# Altium project STM32_Clock.PrjPcb
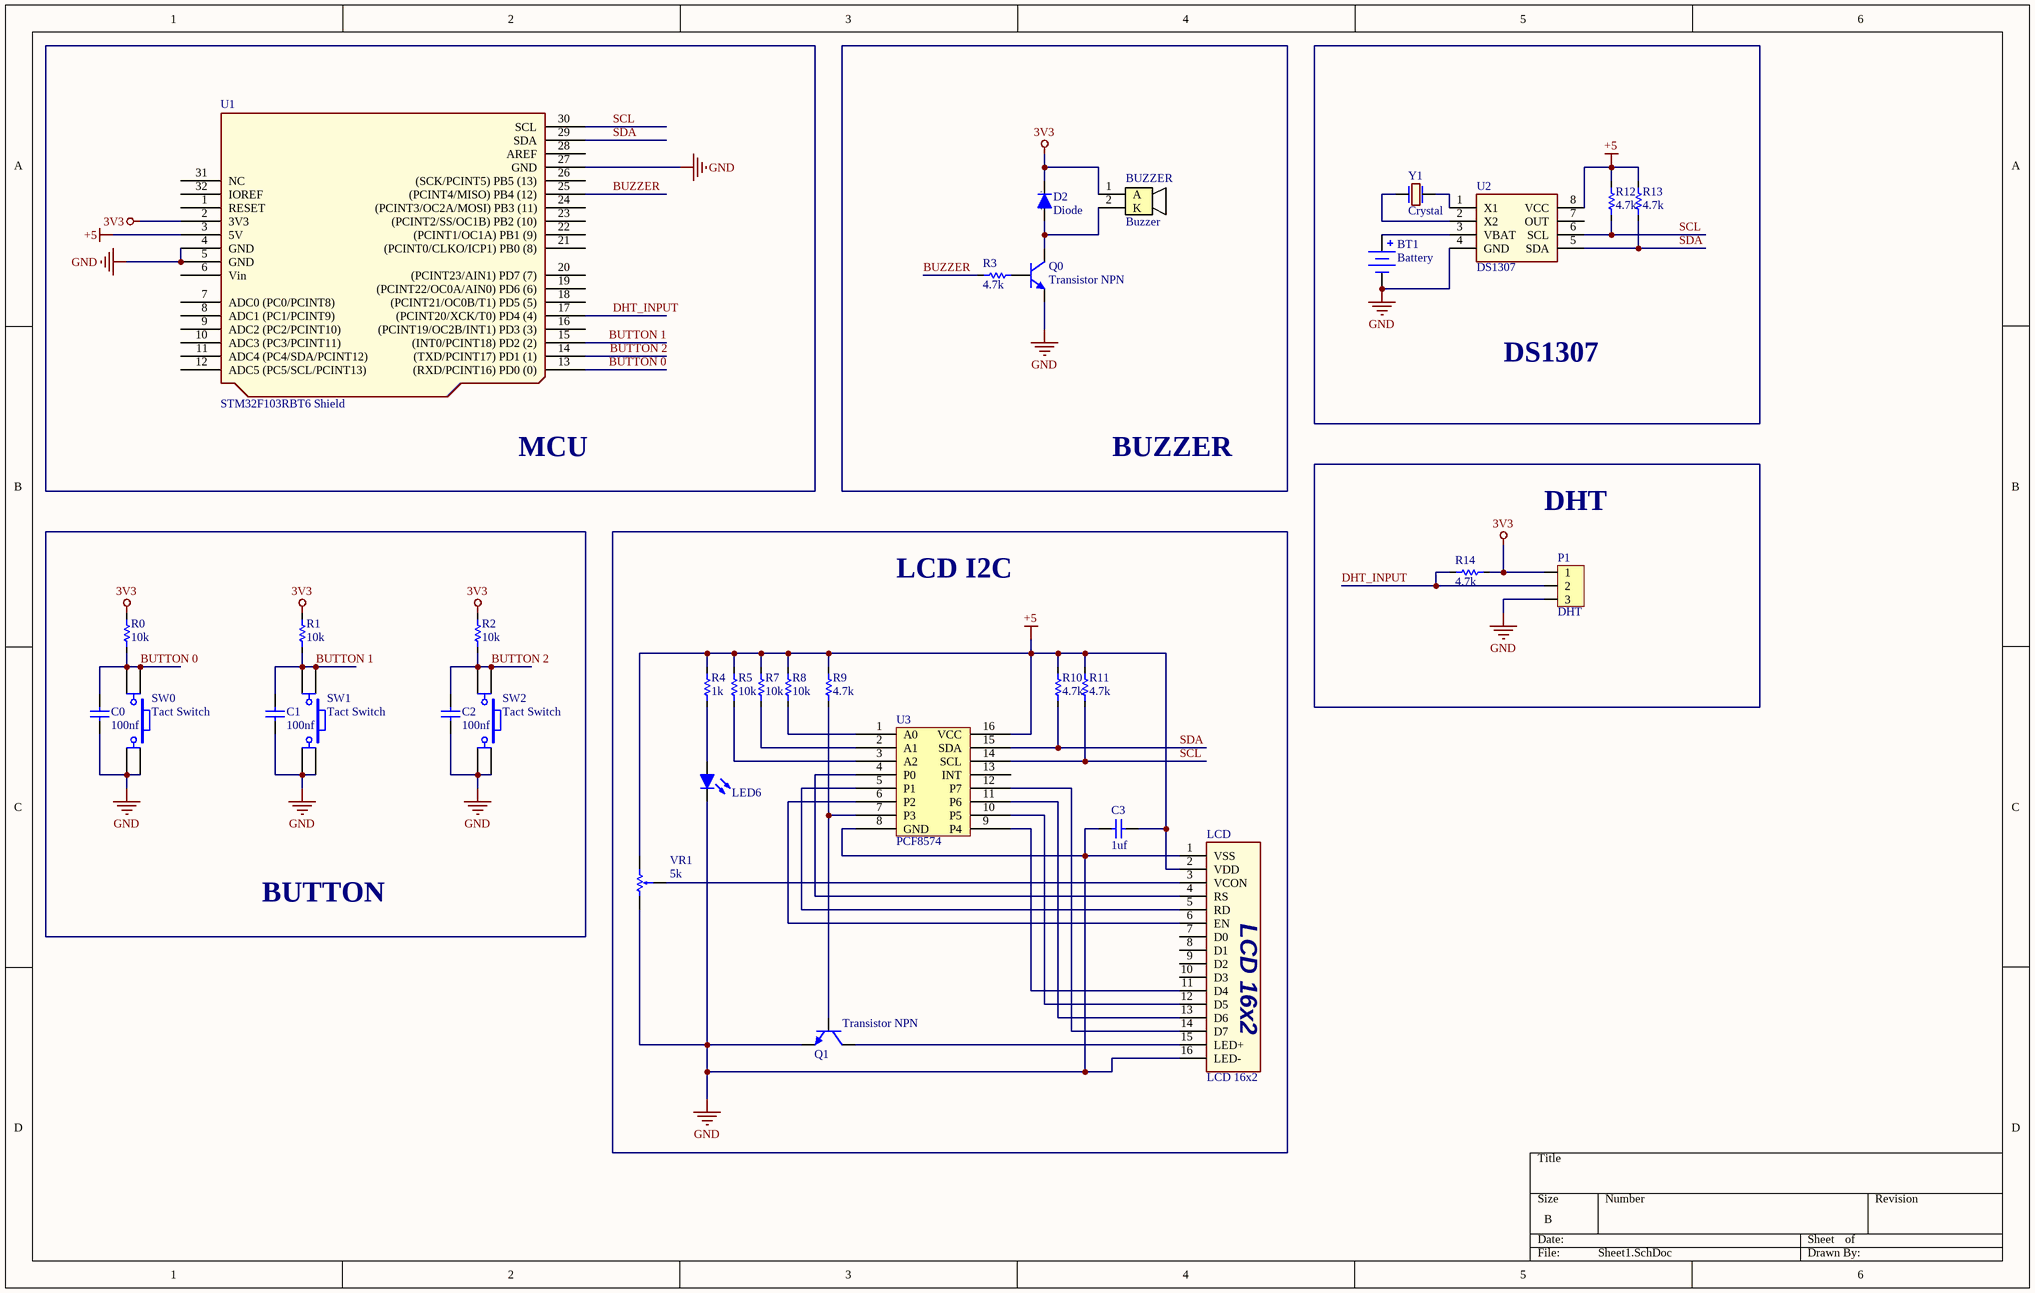
[diagram p0: Sheet1.SchDoc]
1 sheet, 34 parts. Net scope: global (net labels, ports and power ports of the same name join across sheets).
Board file: PCB1.PcbDoc

## Sheet Sheet1.SchDoc
size B; SheetNumber: 1; SheetTotal: 1

### Parts
BT1  Battery  [CON CR2032]
BUZZER  Buzzer  [BUZZER]
C0  100nf  [C 0805 (2012)]
C1  100nf  [C 0805 (2012)]
C2  100nf  [C 0805 (2012)]
C3  1uf  [C 0805 (2012)]
D2  Diode  [SOD-80]
LCD  LCD 16x2  [LCD 16x2]
LED6  Led  [Led SMD 0805]  (value not drawn)
P1  DHT  [XH2.54-3P]
Q0  Transistor NPN  [SOT-23]
Q1  Transistor NPN  [SOT-23]
R0  10k  [R 0805 (2012)]
R1  10k  [R 0805 (2012)]
R2  10k  [R 0805 (2012)]
R3  4.7k  [R 0805 (2012)]
R4  1k  [R 0805 (2012)]
R5  10k  [R 0805 (2012)]
R7  10k  [R 0805 (2012)]
R8  10k  [R 0805 (2012)]
R9  4.7k  [R 0805 (2012)]
R10  4.7k  [R 0805 (2012)]
R11  4.7k  [R 0805 (2012)]
R12  4.7k  [R 0805 (2012)]
R13  4.7k  [R 0805 (2012)]
R14  4.7k  [R 0805 (2012)]
SW0  Tact Switch  [SW/4/DIP 12x12x7]
SW1  Tact Switch  [SW/4/DIP 12x12x7]
SW2  Tact Switch  [SW/4/DIP 12x12x7]
U1  STM32F103RBT6 Shield  [Arduino Uno R3 Shield 2xPins]
U2  DS1307  [DIP 8]
U3  PCF8574  [SOIC127P1032X265-16N]
VR1  5k  [R Var 3mm]
Y1  Crystal  [Crystal DIP-2]

### Nets
3V3: BUZZER.1(A) D2.1(Cathode) P1.1 R0.2 R1.2 R2.2 R14.1 U1.2(3V3)
+5: C3.2 LCD.2(VDD) R4.2 R5.2 R7.2 R8.2 R9.2 R10.2 R11.2 R12.2 R13.2 U1.3(5V) U2.8(VCC) U3.16(VCC) VR1.1
GND: BT1.2(GND) C0.2 C1.2 C2.2 C3.1 LCD.1(VSS) LCD.16(LED-) LED6.1(K) P1.3 Q0.2(E) Q1.2(E) SW0.2 SW0.3 SW1.2 SW1.3 SW2.2 SW2.3 U1.4(GND) U1.5(GND) U1.27(GND) U2.4(GND) U3.8(GND) VR1.3
BUTTON 0: C0.1 R0.1 SW0.1 SW0.4 U1.13((RXD/PCINT16)_PD0_(0))
BUTTON 1: C1.1 R1.1 SW1.1 SW1.4 U1.15((INT0/PCINT18)_PD2_(2))
BUTTON 2: C2.1 R2.1 SW2.1 SW2.4 U1.14((TXD/PCINT17)_PD1_(1))
BUZZER: R3.1 U1.25((PCINT4/MISO)_PB4_(12))
DHT_INPUT: P1.2 R14.2 U1.17((PCINT20/XCK/T0)_PD4_(4))
SCL: R11.1 R12.1 U1.30(SCL) U2.6(SCL) U3.14(SCL)
SDA: R10.1 R13.1 U1.29(SDA) U2.5(SDA) U3.15(SDA)
NetBT1_1: BT1.1(VCC) U2.3(VBAT)
NetBUZZER_2: BUZZER.2(K) D2.2(Anode) Q0.3(C)
NetLCD_3: LCD.3(VCON) VR1.2
NetLCD_4: LCD.4(RS) U3.4(P0)
NetLCD_5: LCD.5(RD) U3.5(P1)
NetLCD_6: LCD.6(EN) U3.6(P2)
NetLCD_11: LCD.11(D4) U3.9(P4)
NetLCD_12: LCD.12(D5) U3.10(P5)
NetLCD_13: LCD.13(D6) U3.11(P6)
NetLCD_14: LCD.14(D7) U3.12(P7)
NetLCD_15: LCD.15(LED+) Q1.3(C)
NetLED6_2: LED6.2(A) R4.1
NetQ0_1: Q0.1(B) R3.2
NetQ1_1: Q1.1(B) R9.1 U3.7(P3)
NetR5_1: R5.1 U3.3(A2)
NetR7_1: R7.1 U3.2(A1)
NetR8_1: R8.1 U3.1(A0)
NetU2_1: U2.1(X1) Y1.2
NetU2_2: U2.2(X2) Y1.1

Not connected (* = marked no-connect by the designer): LCD 7(D0) 8(D1) 9(D2) 10(D3); U1 1(RESET) 6(Vin) 7(ADC0_(PC0/PCINT8)) 8(ADC1_(PC1/PCINT9)) 9(ADC2_(PC2/PCINT10)) 10(ADC3_(PC3/PCINT11)) 11(ADC4_(PC4/SDA/PCINT12)) 12(ADC5_(PC5/SCL/PCINT13)) 16((PCINT19/OC2B/INT1)_PD3_(3)) 18((PCINT21/OC0B/T1)_PD5_(5)) 19((PCINT22/OC0A/AIN0)_PD6_(6)) 20((PCINT23/AIN1)_PD7_(7)) 21((PCINT0/CLKO/ICP1)_PB0_(8)) 22((PCINT1/OC1A)_PB1_(9)) 23((PCINT2/SS/OC1B)_PB2_(10)) 24((PCINT3/OC2A/MOSI)_PB3_(11)) 26((SCK/PCINT5)_PB5_(13)) 28(AREF) 31(NC) 32(IOREF); U2 7(OUT); U3 13(INT)

### Notes on the sheet
- DS1307
- MCU
- BUZZER
- DHT
- LCD I2C
- BUTTON
- (in symbol Diode) k; a

### Library data of the parts
C0-C3 = Capacitor NP: Capacitor non-pol
D2 = Diode: Default Diode; Published: 8-Jun-2000; LatestRevisionDate: 17-Jul-2002; LatestRevisionNote: Re-released for DXP Platform.; PackageVersion: Sep-1996; PackageReference: SMC; Publisher: Altium Limited; Code_JEDEC: DO-214-AB
LCD = LCD 16x2: Character LCD 16x2
LED6 = Led: Typical LED
P1 = Header 3: Header, 3-Pin
Q0 Q1 = Transistor NPN: NPN Bipolar Transistor
R0-R5 R7-R14 = Resistor: Published: 8-Jun-2000; LatestRevisionDate: 17-Jul-2002; LatestRevisionNote: Re-released for DXP Platform.; PackageReference: AXIAL-0.3; Publisher: Altium Limited
SW0-SW2 = SW SPST-4: Tact switch 4 pin
U1 = Arduino Uno R3 shield: Arduino Uno R3 shield pins connection
U3 = PCF8574: Remote 8-Bit I/O Expander for I  2C Bus
VR1 = Resistor Variable